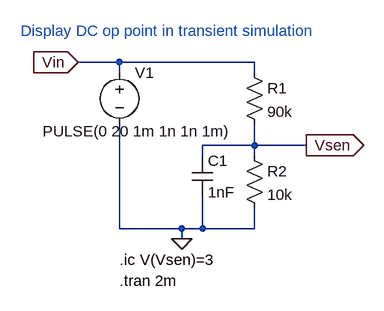
[diagram p0: schematic LTspice 03-2 Display DC op point.asc]
LTspice 03-2 Display DC op point.asc, the LTspice schematic file:
Version 4
SHEET 1 1576 680
WIRE 400 192 336 192
WIRE 608 192 400 192
WIRE 400 208 400 192
WIRE 608 208 608 192
WIRE 608 320 608 288
WIRE 608 320 528 320
WIRE 688 320 608 320
WIRE 528 336 528 320
WIRE 608 336 608 320
WIRE 400 448 400 288
WIRE 496 448 400 448
WIRE 528 448 528 400
WIRE 528 448 496 448
WIRE 608 448 608 416
WIRE 608 448 528 448
WIRE 496 464 496 448
FLAG 496 464 0
FLAG 688 320 Vsen
IOPIN 688 320 Out
FLAG 336 192 Vin
IOPIN 336 192 In
DATAFLAG 512 192 ""
DATAFLAG 640 320 ""
DATAFLAG 592 192 ""
SYMBOL voltage 400 192 R0
WINDOW 123 0 0 Left 2
WINDOW 39 0 0 Left 2
WINDOW 3 -118 106 Left 2
SYMATTR Value PULSE(0 20 1m 1n 1n 1m)
SYMATTR InstName V1
SYMBOL res 592 192 R0
SYMATTR InstName R1
SYMATTR Value 90k
SYMBOL res 592 320 R0
SYMATTR InstName R2
SYMATTR Value 10k
SYMBOL cap 512 336 R0
SYMATTR InstName C1
SYMATTR Value 1nF
TEXT 248 144 Left 2 ;Display DC op point in transient simulation
TEXT 400 528 Left 2 !.tran 2m
TEXT 400 496 Left 2 !.ic V(Vsen)=3

The netlist it stands for:
* LTspice 03-2 Display DC op point.asc
V1 Vin 0 PULSE(0 20 1m 1n 1n 1m)
R1 Vin Vsen 90k
R2 Vsen 0 10k
C1 Vsen 0 1nF
* Display DC op point in transient simulation
.tran 2m
.ic V(Vsen)=3
.backanno
.end